# EasyEDA schematic LED_Clock_sch_ver1.json
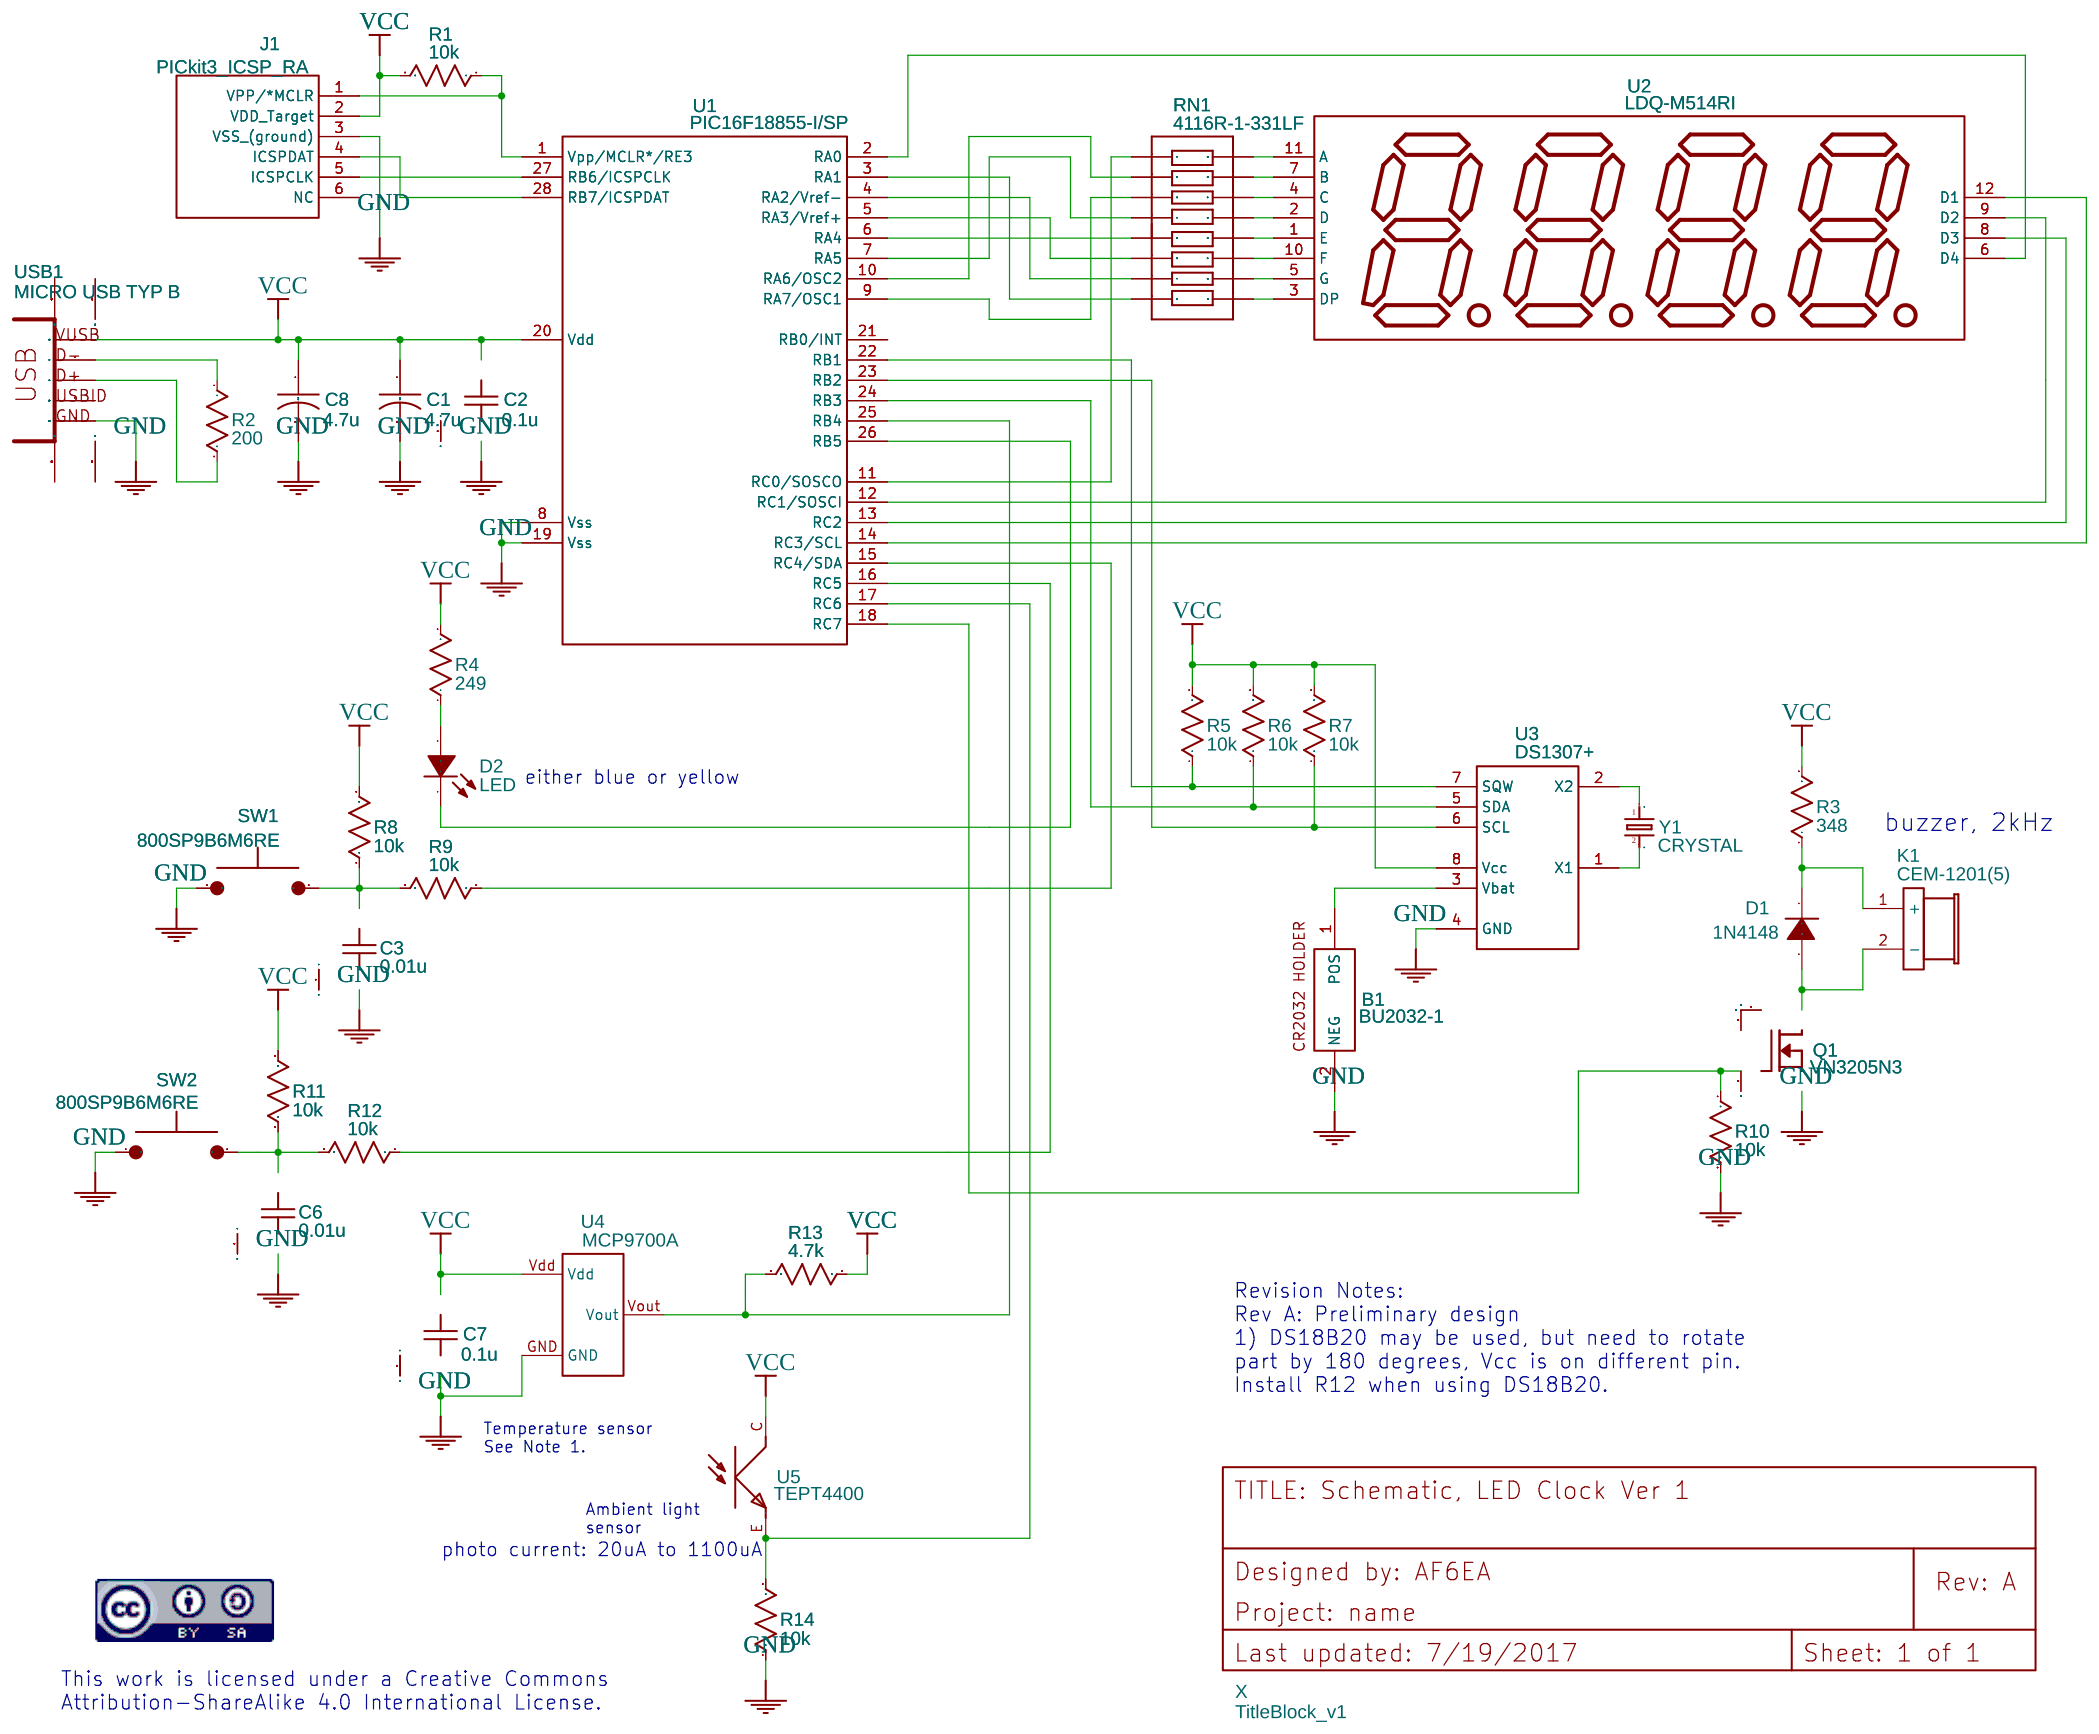
[diagram p0: schematic sheet]

## Parts
B1  BU2032-1  [BU2032-1]
C1  4.7u  [Pan_EF_I]
C2  0.1u  [Vishay_K_15L2]
C3  0.01u  [Vishay_K_15L2]
C6  0.01u  [Vishay_K_15L2]
C7  0.1u  [Vishay_K_15L2]
C8  4.7u  [Pan_EF_I]
D1  1N4148  [DO-35]
D2  LED  [5mm LED]
J1  PICkit3_ICSP_RA  [68016-406HLF]
K1  CEM-1201(5)  [CEM-1201(50)]
Q1  VN3205N3  [TO-92]
R1  10k  [RFN14]
R2  200  [RFN14]
R3  348  [RFN14]
R4  249  [RFN14]
R5  10k  [RFN14]
R6  10k  [RFN14]
R7  10k  [RFN14]
R8  10k  [RFN14]
R9  10k  [RFN14]
R10  10k  [RFN14]
R11  10k  [RFN14]
R12  10k  [RFN14]
R13  4.7k  [RFN14]
R14  10k  [RFN14]
RN1  4116R-1-331LF  [DIP16]
SW1  800SP9B6M6RE  [800SP9B6M6RE]
SW2  800SP9B6M6RE  [800SP9B6M6RE]
U1  PIC16F18855-I/SP  [DIP28]
U2  LDQ-M514RI  [LDQ-M514RI]
U3  DS1307+  [DIP8]
U4  MCP9700A  [MCP9700A]
U5  TEPT4400  [TEPT4400]
USB1  MICRO USB TYP B  [CONN_USB_MICRO-B]
X  TitleBlock_v1  [Titleblock]
Y1  CRYSTAL  [CDX-1038]

## Library data of the parts
B1 = -: Supplier: Digi-Key; Digi-Key: BU2032-1-ND; link: http://www.digikey.com/scripts/DkSearch/dksus.dll?Detail&itemSeq=214261724&uq=636176761339222333; Contributor: tcirineo
C1 C8 = Capacitor: Manufacturer Part: ?
C2 C7 = Capacitor: Manufacturer Part: K104K15X7RF5TL2; Supplier: Digi-Key; Digi-Key: BC1084CT-ND
C3 C6 = Capacitor: Manufacturer Part: K103K15X7RF5TL2; Supplier: Digi-Key; Digi-Key: BC1078CT-ND
D1 = Diode: Supplier: Digi-Key; Digi-Key: 1N4148FS-ND
D2 = LED: Manufacturer Part: ?
J1 = -: Supplier: Digi-Key; Digi-Key: 609-3327-ND; link: http://www.digikey.com/scripts/DkSearch/dksus.dll?Detail&itemSeq=233680912&uq=636360938042645415; Contributor: tcirineo
K1 = -: Supplier: Digi-Key; Digi-Key: 102-1152-ND; link: http://www.digikey.com/scripts/DkSearch/dksus.dll?Detail&itemSeq=214926886&uq=636180425464287670; Contributor: tcirineo
Q1 = NMOS: Manufacturer Part: VN3205N3-G; Supplier: Digi-Key; Digi-Key: VN3205N3-G-ND
R1 R2 R5-R12 = Resistor: Manufacturer Part: RNF14FTD10K0; Supplier: Digi-Key; Digi-Key: RNF14FTD10K0CT-ND
R3 = Resistor: Manufacturer Part: MFR-25FBF52-1K; Supplier: Digi-Key; Digi-Key: 1.00KXBK-ND
R4 = Resistor: Manufacturer Part: RNF14FTD249R; Supplier: Digi-Key; Digi-Key: RNF14FTD249RCT-ND
R13 = Resistor: Manufacturer Part: RNMF14FTC4K70; Supplier: Digi-Key; Digi-Key: S4.7KCACT-ND
R14 = Resistor: Manufacturer Part: RC0603FR-0710KL; Supplier: Digi-Key; Digi-Key: 311-10.0KHRCT-ND
RN1 = -: Supplier: Digi-Key; Digi-Key: 4116R-1-331LF-ND; link: http://www.digikey.com/scripts/DkSearch/dksus.dll?Detail&itemSeq=215068158&uq=636190722824752552; Contributor: tcirineo
SW1 SW2 = -: Supplier: Digi-Key; Digi-Key: EG2615-ND; link: http://www.digikey.com/scripts/DkSearch/dksus.dll?Detail&itemSeq=232711922&uq=636360904919605415; Contributor: tcirineo
U1 = -: Supplier: Digi-Key; Digi-Key: PIC16F18855-I/SP-ND; link: http://www.digikey.com/products/en/integrated-circuits-ics/embedded-microcontrollers/685?k=PIC16F18855&k=&pkeyword=PIC16F18855&pv1291=6302&FV=ffe002ad&mnonly=0&newproducts=0&ColumnSort=0&page=1&stock=1&quantity=0&ptm=0&fid=0&pageSize=25; Contributor: tcirineo
U2 = -: Supplier: Digi-Key; Digi-Key: 67-1439-ND; link: https://www.digikey.com/products/en?keywords=LDQ-M514RI; Contributor: tcirineo
U3 = -: Supplier: Digi-Key; Digi-Key: DS1307+-ND; link: http://www.digikey.com/scripts/DkSearch/dksus.dll?Detail&itemSeq=213986429&uq=636176787435354320; Contributor: tcirineo
U4 = -: Supplier: Digi-Key; Digi-Key: MCP9700A-E/TO-ND; link: http://www.digikey.com/scripts/DkSearch/dksus.dll?Detail&itemSeq=215360231&uq=636190714661932156; Contributor: tcirineo
U5 = -: Supplier: Digi-Key; Digi-Key: 751-1057-ND; link: https://www.digikey.com/products/en?keywords=tept4400; Contributor: tcirineo
USB1 = -: USB Female connector; catid: 20; Contributor: DangerousPrototype; sourceId: I1dbL75qo; Manufacturer Part: ?
X = -: Contributor: tcirineo
Y1 = -: catid: 20; Contributor: SparkFun; Manufacturer Part: AB38T-32.768KHZ; Supplier: Digi-Key; Digi-Key: 535-9034-ND

## Nets
GND: B1.2(NEG) C1.2 C2.1 C3.1 C6.1 C7.1 C8.2 J1.3(VSS (ground)) Q1.2(S) R10.2 R14.1 SW1.1 SW2.1 U1.8(Vss) U1.19(Vss) U3.4(GND) U4.GND USB1.P5(GND)
VCC: C1.1 C2.2 C7.2 C8.1 J1.2(VDD Target) R1.2 R3.2 R4.2 R5.2 R6.2 R7.2 R8.2 R11.2 R13.1 U1.20(Vdd) U3.8(Vcc) U4.Vdd U5.C USB1.P1(VUSB)
D2_A: D2.A R4.1
K1_1: D1.K K1.1(+) R3.1
K1_2: D1.A K1.2(-) Q1.3(D)
Net-(R13-2): R13.2 U1.25(RB4) U4.Vout
R1_1: J1.1(VPP/*MCLR) R1.1 U1.1(Vpp/MCLR*/RE3)
R2_2: R2.2 USB1.P3(D+)
R9_2: C3.2 R8.1 R9.2 SW1.2
R12_2: C6.2 R11.1 R12.2 SW2.2
RN1_2: RN1.2 U1.10(RA6/OSC2)
RN1_3: RN1.3 U1.9(RA7/OSC1)
RN1_5: RN1.5 U1.6(RA4)
RN1_6: RN1.6 U1.5(RA3/Vref+)
RN1_7: RN1.7 U1.4(RA2/Vref-)
RN1_8: RN1.8 U1.3(RA1)
RN1_9: RN1.9 U2.3(DP)
RN1_10: RN1.10 U2.5(G)
RN1_11: RN1.11 U2.10(F)
RN1_12: RN1.12 U2.1(E)
RN1_13: RN1.13 U2.2(D)
RN1_14: RN1.14 U2.4(C)
RN1_15: RN1.15 U2.7(B)
RN1_16: RN1.16 U2.11(A)
U1_7: RN1.4 U1.7(RA5)
U1_11: RN1.1 U1.11(RC0/SOSCO)
U1_12: U1.12(RC1/SOSCI) U2.9(D2)
U1_14: U1.14(RC3/SCL) U2.12(D1)
U1_15: R9.1 U1.15(RC4/SDA)
U1_16: R12.1 U1.16(RC5)
U1_18: Q1.1(G) R10.1 U1.18(RC7)
U1_22: R5.1 U1.22(RB1) U3.7(SQW)
U1_23: R7.1 U1.23(RB2) U3.6(SCL)
U1_24: R6.1 U1.24(RB3) U3.5(SDA)
U1_26: D2.K U1.26(RB5)
U1_27: J1.5(ICSPCLK) U1.27(RB6/ICSPCLK)
U1_28: J1.4(ICSPDAT) U1.28(RB7/ICSPDAT)
U2_6: U1.2(RA0) U2.6(D4)
U2_8: U1.13(RC2) U2.8(D3)
U3_1: U3.1(X1) Y1.2
U3_3: B1.1(POS) U3.3(Vbat)
U5_E: R14.2 U1.17(RC6) U5.E
USB1_P2: R2.1 USB1.P2(D-)
Y1_1: U3.2(X2) Y1.1

Not connected (* = marked no-connect by the designer): J1 6(NC); U1 21(RB0/INT); USB1 BODY@1(BODY) BODY@2(BODY) BODY@3(BODY) BODY@4(BODY) P4(USBID)

## Notes on the sheet
- either blue or yellow
- buzzer, 2kHz
- Revision Notes:
  Rev A: Preliminary design
  1) DS18B20 may be used, but need to rotate
  part by 180 degrees, Vcc is on different pin.
  Install R12 when using DS18B20.
- Temperature sensor
  See Note 1.
- Ambient light
  sensor
- photo current: 20uA to 1100uA
- This work is licensed under a Creative Commons
  Attribution-ShareAlike 4.0 International License.
